# Altium schematic sheet Power Regulation.SchDoc
size A4; Engineer: Naif Aljohani; DocumentNumber: 7; Revision: v1.0; SheetNumber: 7; SheetTotal: 8
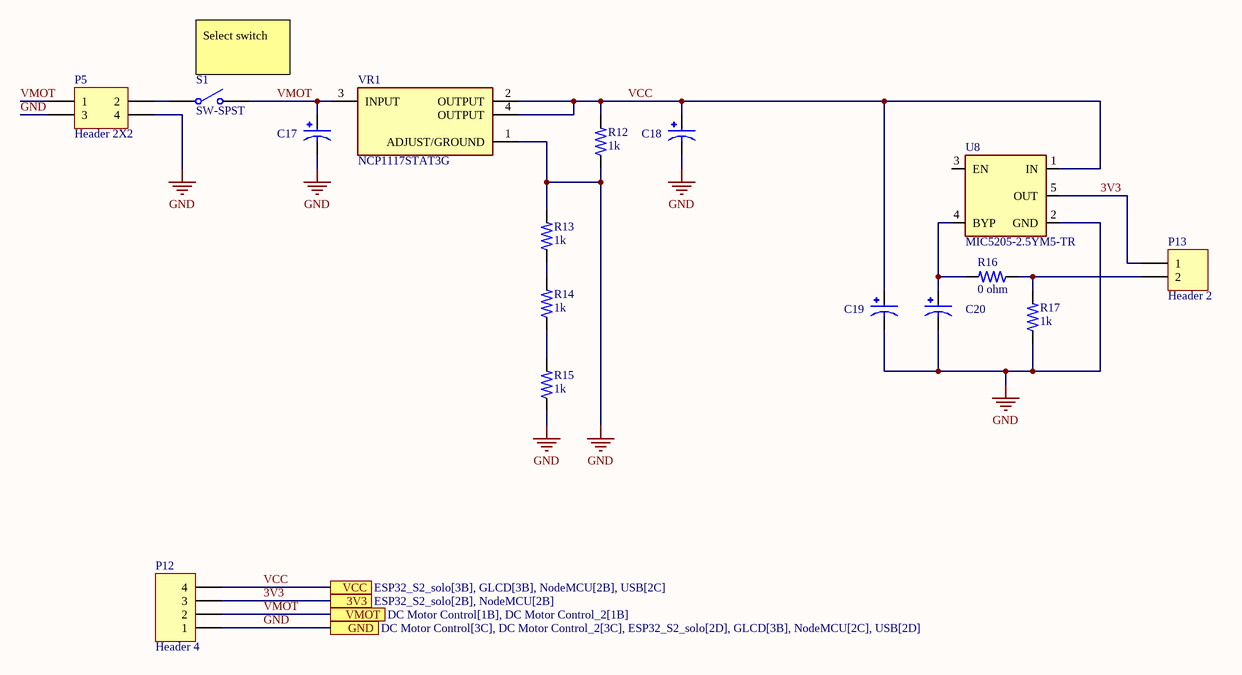
[diagram p0: Power Regulation.SchDoc]

## Parts
C17  EEEHA1V101UP  [CAP_EEEHA1V101UP]  (value not drawn)
C18  EEEHA1V101UP  [CAP_EEEHA1V101UP]  (value not drawn)
C19  EEEHA1V101UP  [CAP_EEEHA1V101UP]  (value not drawn)
C20  EEEHA1V101UP  [CAP_EEEHA1V101UP]  (value not drawn)
P5  Header 2X2  [HDR2X2]
P12  Header 4  [HDR1X4]
P13  Header 2  [HDR1X2]
R12  1k  [RESC3115X65N]
R13  1k  [RESC3115X65N]
R14  1k  [RESC3115X65N]
R15  1k  [RESC3115X65N]
R16  0 ohm  [RESC3115X65N]
R17  1k  [RESC3115X65N]
S1  SW-SPST  [SPST-2]
U8  MIC5205-2.5YM5-TR  [SOT95P280X145-5N]
VR1  NCP1117STAT3G  [VREG_NCP1117STAT3G]

## Ports
3V3 (see ESP32_S2_solo[2B], NodeMCU[2B]), GND (see DC Motor Control[3C], DC Motor Control_2[3C], ESP32_S2_solo[2D], GLCD[3B], NodeMCU[2C], USB[2D]), VCC (see ESP32_S2_solo[3B], GLCD[3B], NodeMCU[2B], USB[2C]), VMOT (see DC Motor Control[1B], DC Motor Control_2[1B])

## Nets
GND: C17.2 C18.2 C19.2 C20.2 P5.3 P5.4 P12.1 R12.1 R13.2 R15.1 R17.1 U8.2(GND) VR1.1(ADJUST/GROUND) ; port GND
3V3: P12.3 P13.1 U8.5(OUT) ; port 3V3
VCC: C18.1 C19.1 P12.4 R12.2 U8.1(IN) VR1.2(OUTPUT) VR1.4(OUTPUT) ; port VCC
VMOT: C17.1 P5.1 P12.2 S1.2(NO) VR1.3(INPUT) ; port VMOT
NetC20_1: C20.1 R16.2 U8.4(BYP)
NetP5_2: P5.2 S1.1(COMMON)
NetP13_2: P13.2 R16.1 R17.2
NetR13_1: R13.1 R14.2
NetR14_1: R14.1 R15.2

Not connected (* = marked no-connect by the designer): U8 3(EN)

## Notes on the sheet
- (near S1) Select switch

## Library data of the parts
C17-C20 = EEEHA1V101UP: MF: {'manufacturer': u'Panasonic'}; Value: *; MP: EEEHA1V101UP; Availability: Unavailable; Package: None; Price: None
P5 = Header 2X2: Header, 2-Pin, Dual row; LatestRevisionDate: 17-Jul-2002; LatestRevisionNote: Re-released for DXP Platform.; Publisher: Altium Limited
P12 = Header 4: Header, 4-Pin; LatestRevisionDate: 17-Jul-2002; LatestRevisionNote: Re-released for DXP Platform.; Publisher: Altium Limited
P13 = Header 2: Header, 2-Pin; LatestRevisionDate: 17-Jul-2002; LatestRevisionNote: Re-released for DXP Platform.; Publisher: Altium Limited
R12-R17 = 1-1879462-4: RL73H 2B R43 1% 10 RL; MF: {'manufacturer': u'TE Connectivity'}; Package: None; Price: None; Value: *; MP: 1-1879462-4; Availability: Unavailable
S1 = SW-SPST: Single-Pole, Single-Throw Switch; Published: 24-Mar-1999; LatestRevisionDate: 17-Jul-2002; LatestRevisionNote: Re-released for DXP Platform.; PackageReference: SPST-2; Publisher: Altium Limited; PackageDescription: Switch; 2 Leads
U8 = MIC5205-2.5YM5-TR: MIC5205 Series 3 V Fixed Output 150 mA SMT Low-Noise LDO Regulator - SOT-23-5; MF: {'manufacturer': u'Microchip Technology'}; Price: None; MP: MIC5205-2.5YM5-TR; Availability: Unavailable; Value: *; Package: None
VR1 = NCP1117STAT3G: Linear Voltage Regulator IC 1 Output 1A SOT-223; MF: {'manufacturer': u'ON Semiconductor'}; Value: *; MP: NCP1117STAT3G; Availability: Unavailable; Package: None; Price: None